# Altium project AudioDSP-v3.0.PrjPcb
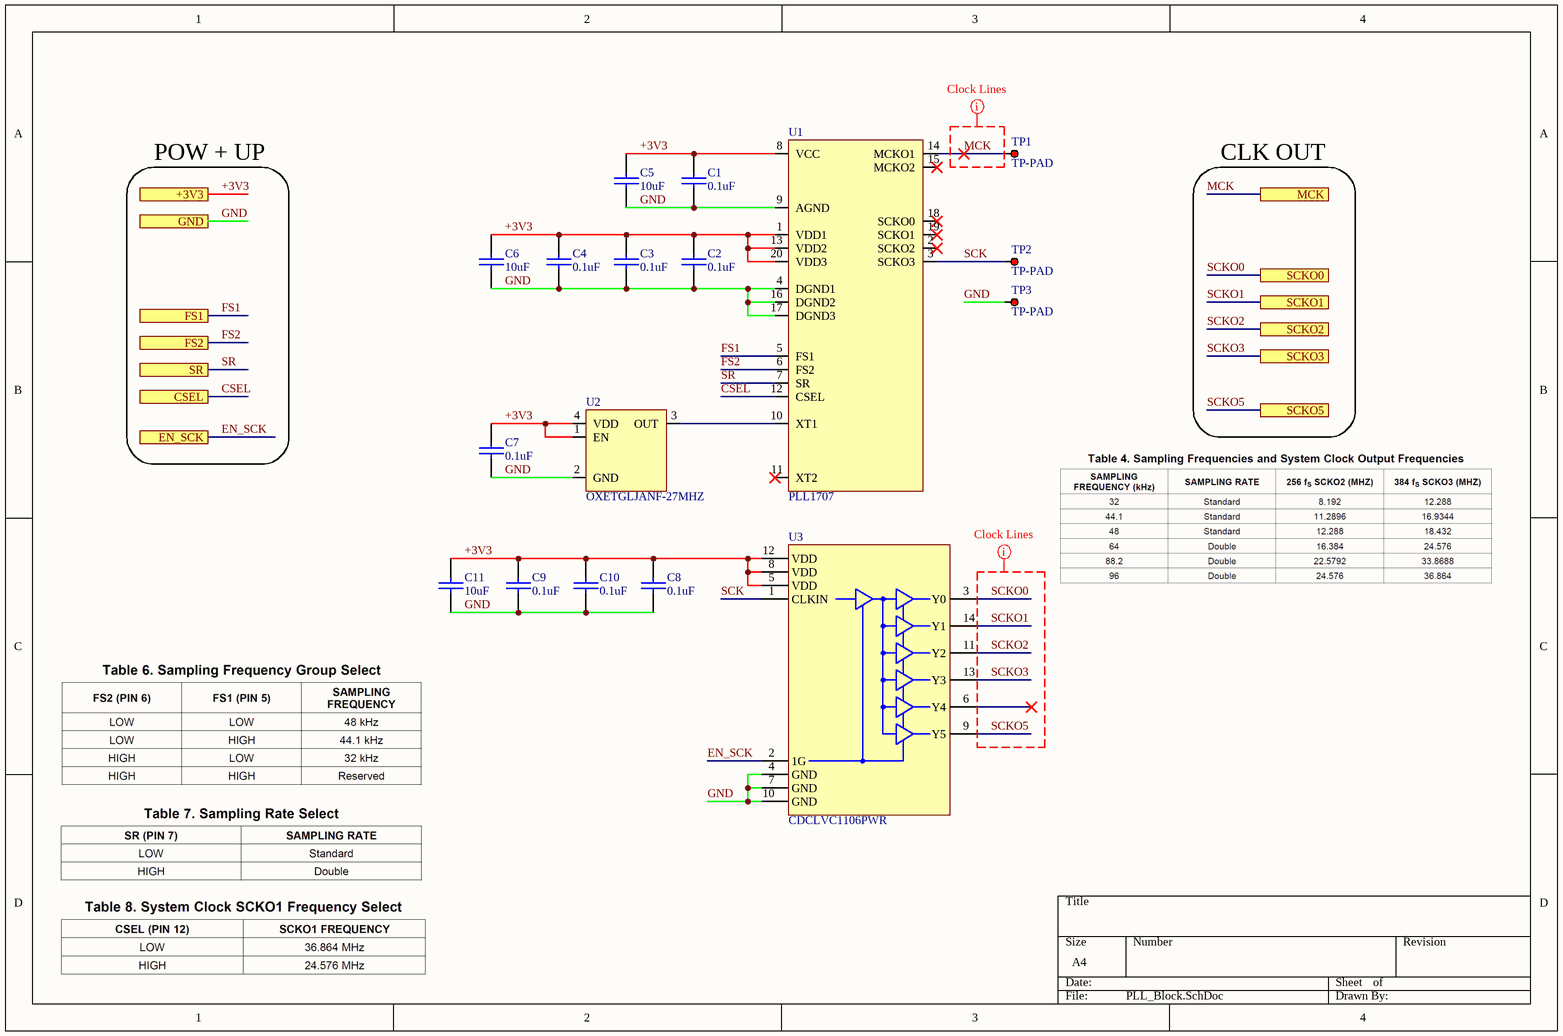
[diagram p0: PLL_Block.SchDoc]
11 sheets, 124 parts. Net scope: hierarchical (ports join the sheet entries above them; power ports are global).
Board file: AudioDSP-3.0.PcbDoc
Sheets:
  PLL_Block.SchDoc
  DAC_Block.SchDoc
  POW_Block.SchDoc
  IN_Connectors.SchDoc
  OUT_Connectors.SchDoc
  MCU_Block.SchDoc
  CTRL_Connectors.SchDoc
  ADC_Interface.SchDoc
  LPF_Interface.SchDoc
    LPF1 = LPF_Block.SchDoc
  DSP_Block.SchDoc

## Sheet PLL_Block.SchDoc
size A4; SheetNumber: 2; SheetTotal: 13

### Parts
(Parts that share a designator on the sheet are numbered #1, #2 ... from top to bottom, then left to right.)
C1#1  0.1uF  [0402-CAP-TDK]
C2#1  0.1uF  [0402-CAP-TDK]
C3#1  0.1uF  [0402-CAP-TDK]
C4#1  0.1uF  [0402-CAP-TDK]
C5#1  10uF  [0603-CAP-TDK]
C6#1  10uF  [0603-CAP-TDK]
C7#1  0.1uF  [0402-CAP-TDK]
C8#1  0.1uF  [0402-CAP-TDK]
C9#1  0.1uF  [0402-CAP-TDK]
C10#1  0.1uF  [0402-CAP-TDK]
C11#1  10uF  [0603-CAP-TDK]
TP1#1  TP-PAD  [TPTH - PAD TOP]  (no BOM)
TP2#1  TP-PAD  [TPTH - PAD TOP]  (no BOM)
TP3#1  TP-PAD  [TPTH - PAD TOP]  (no BOM)
U1#1  PLL1707  [TI-SSOP-20 - DBQ (R-PDSO-G20)]
U2#1  OXETGLJANF-27MHZ  [SMD3225]
U3  CDCLVC1106PWR  [TI-TSSOP-14-PW0014A]

### Ports
+3V3 (see AudioDSP-v3.0.0c_top[2C], ADC_Block[1A], ADC_Interface[1B], CTRL_Connectors[1A], DAC_Block[1B], DSP_Block[1A], MCU_Block[1A], POW_Block[4B]), CSEL (see AudioDSP-v3.0.0c_top[2C], MCU_Block[4C]), EN_SCK (see AudioDSP-v3.0.0c_top[2C], MCU_Block[4B]), FS1 (see AudioDSP-v3.0.0c_top[2C], MCU_Block[4B]), FS2 (see AudioDSP-v3.0.0c_top[2C], MCU_Block[4B]), GND (see AudioDSP-v3.0.0c_top[2C], ADC_Block[1B], ADC_Interface[1B], CTRL_Connectors[1A], DAC_Block[1B], DSP_Block[1A], IN_Connectors[3A], LPF_Block[1B], LPF_Interface[1B], MCU_Block[1B], OUT_Connectors[3B], POW_Block[1B]), MCK (see AudioDSP-v3.0.0c_top[3C]), SCKO0 (see AudioDSP-v3.0.0c_top[3C]), SCKO1 (see AudioDSP-v3.0.0c_top[3C]), SCKO2 (see AudioDSP-v3.0.0c_top[3C]), SCKO3 (see AudioDSP-v3.0.0c_top[3C]), SCKO5 (see AudioDSP-v3.0.0c_top[3C]), SR (see AudioDSP-v3.0.0c_top[2C], MCU_Block[4C])

### Nets
+3V3: C1#1.2 C2#1.2 C3#1.2 C4#1.2 C5#1.2 C6#1.2 C7#1.2 C8#1.2 C9#1.2 C10#1.2 C11#1.2 U1#1.1(VDD1) U1#1.8(VCC) U1#1.13(VDD2) U1#1.20(VDD3) U2#1.1(EN) U2#1.4(VDD) U3.5(VDD) U3.8(VDD) U3.12(VDD) ; port +3V3
CSEL: U1#1.12(CSEL) ; port CSEL
EN_SCK: U3.2(1G) ; port EN_SCK
FS1: U1#1.5(FS1) ; port FS1
FS2: U1#1.6(FS2) ; port FS2
GND: C1#1.1 C2#1.1 C3#1.1 C4#1.1 C5#1.1 C6#1.1 C7#1.1 C8#1.1 C9#1.1 C10#1.1 C11#1.1 TP3#1.1 U1#1.4(DGND1) U1#1.9(AGND) U1#1.16(DGND2) U1#1.17(DGND3) U2#1.2(GND) U3.4(GND) U3.7(GND) U3.10(GND) ; port GND
MCK: TP1#1.1 U1#1.14(MCKO1) ; port MCK
SCK: TP2#1.1 U1#1.3(SCKO3) U3.1(CLKIN)
SCKO0: U3.3(Y0) ; port SCKO0
SCKO1: U3.14(Y1) ; port SCKO1
SCKO2: U3.11(Y2) ; port SCKO2
SCKO3: U3.13(Y3) ; port SCKO3
SCKO5: U3.9(Y5) ; port SCKO5
SR: U1#1.7(SR) ; port SR
NetU1#1_10: U1#1.10(XT1) U2#1.3(OUT)

Not connected (* = marked no-connect by the designer): U1#1 2(SCKO2)* 11(XT2)* 15(MCKO2)* 18(SCKO0)* 19(SCKO1)*; U3 6(Y4)*

### Layout directives
net class CLK: MCK, SCKO0, SCKO1, SCKO2, SCKO3, SCKO5

### Notes on the sheet
- POW + UP
- CLK OUT

### Library data of the parts
C1#1 C2#1 C3#1 C4#1 C5#1 C6#1 C7#1 C8#1 C9#1 C10#1 C11#1 = CAP-SMD
  C1#1 C2#1 C3#1 C4#1 C7#1 C8#1 C9#1 C10#1: JLCPart: C307331
  C5#1 C6#1 C11#1: JLCPart: C96446
U1#1 = PLL1707: Dual PLL Multi-Clock Generator; JLCPart: C1519963
U2#1 = OXETGLJANF-27MHZ: 3.3V ±50ppm 27MHz SMD3225-4P Oscillators; JLCPart: C295526
U3 = CDCLVC1106PWR: LVCMOS High-Performance Clock Buffer 6-Output; JLCPart: C56506

## Sheet DAC_Block.SchDoc
size A4; SheetNumber: 3; SheetTotal: 13
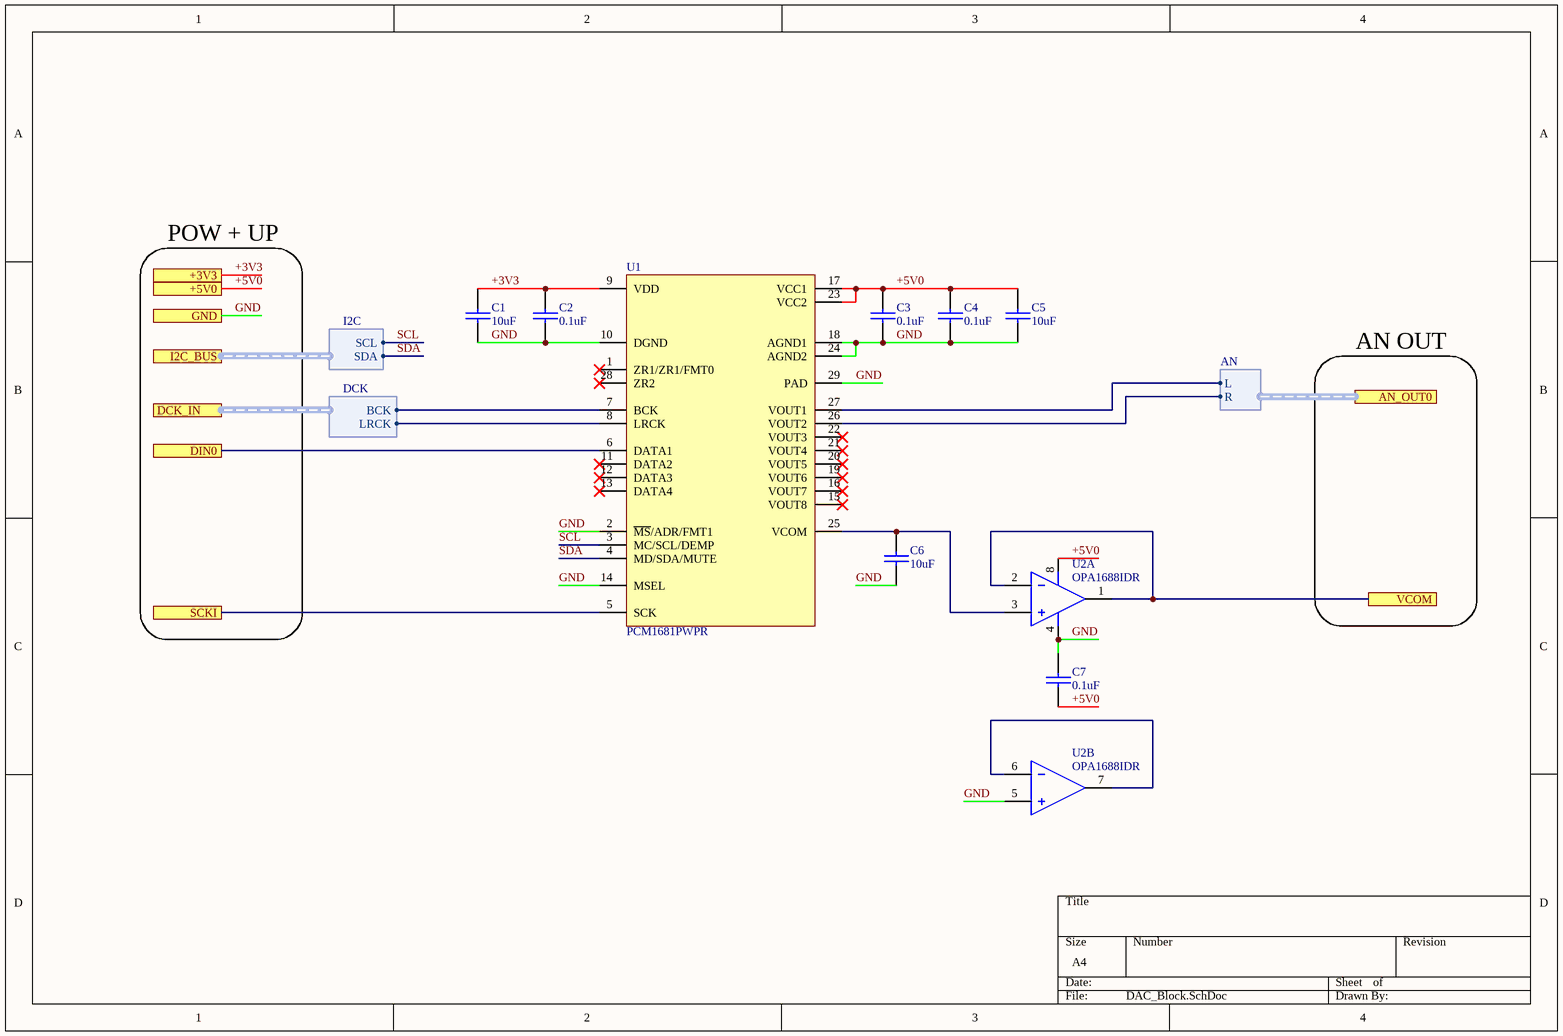
[diagram p1: DAC_Block.SchDoc]

### Parts
(Parts that share a designator on the sheet are numbered #1, #2 ... from top to bottom, then left to right.)
C1#2  10uF  [0603-CAP-TDK]
C2#2  0.1uF  [0402-CAP-TDK]
C3#2  0.1uF  [0402-CAP-TDK]
C4#2  0.1uF  [0402-CAP-TDK]
C5#2  10uF  [0603-CAP-TDK]
C6#2  10uF  [0603-CAP-TDK]
C7#2  0.1uF  [0402-CAP-TDK]
U1#2  PCM1681PWPR  [PCM1681PWPR]
U2#2  OPA1688IDR  [TI-SOIC-8]  (parts A,B of 2)

### Ports
+3V3 (see AudioDSP-v3.0.0c_top[6B], ADC_Block[1A], ADC_Interface[1B], CTRL_Connectors[1A], DSP_Block[1A], MCU_Block[1A], PLL_Block[1A], POW_Block[4B]), +5V0 (see AudioDSP-v3.0.0c_top[6B], LPF_Block[1B], LPF_Interface[1B], POW_Block[4B]), AN_OUT0 (harness AN, see AudioDSP-v3.0.0c_top[6B]), DCK_IN (harness DCK, see AudioDSP-v3.0.0c_top[6B]), DIN0 (see AudioDSP-v3.0.0c_top[6B]), GND (see AudioDSP-v3.0.0c_top[6B], ADC_Block[1B], ADC_Interface[1B], CTRL_Connectors[1A], DSP_Block[1A], IN_Connectors[3A], LPF_Block[1B], LPF_Interface[1B], MCU_Block[1B], OUT_Connectors[3B], PLL_Block[1A], POW_Block[1B]), I2C_BUS (harness I2C, see AudioDSP-v3.0.0c_top[6B], ADC_Block[1B]), SCKI (see AudioDSP-v3.0.0c_top[6B]), VCOM (see AudioDSP-v3.0.0c_top[6B], LPF_Block[1C], LPF_Interface[1B])

### Harnesses
I2C: SCL, SDA
DCK: BCK, LRCK
AN: L, R

### Nets
+3V3: C1#2.2 C2#2.2 U1#2.9(VDD) ; port +3V3
+5V0: C3#2.2 C4#2.2 C5#2.2 C7#2.1 U1#2.17(VCC1) U1#2.23(VCC2) U2#2.8(VDD) ; port +5V0
GND: C1#2.1 C2#2.1 C3#2.1 C4#2.1 C5#2.1 C6#2.1 C7#2.2 U1#2.2(~{MS}/ADR/FMT1) U1#2.10(DGND) U1#2.14(MSEL) U1#2.18(AGND1) U1#2.24(AGND2) U1#2.29(PAD) U2#2.4(GND) U2#2.5(2IN+) ; port GND
SCL: U1#2.3(MC/SCL/DEMP) ; port I2C_BUS.SCL
SDA: U1#2.4(MD/SDA/MUTE) ; port I2C_BUS.SDA
NetC6#2_2: C6#2.2 U1#2.25(VCOM) U2#2.3(1IN+)
NetU1#2_5: U1#2.5(SCK) ; port SCKI
NetU1#2_6: U1#2.6(DATA1) ; port DIN0
NetU1#2_7: U1#2.7(BCK) ; port DCK_IN.BCK
NetU1#2_8: U1#2.8(LRCK) ; port DCK_IN.LRCK
NetU1#2_26: U1#2.26(VOUT2) ; port AN_OUT0.R
NetU1#2_27: U1#2.27(VOUT1) ; port AN_OUT0.L
NetU2#2_1: U2#2.1(1OUT) U2#2.2(1IN-) ; port VCOM
NetU2#2_6: U2#2.6(2IN-) U2#2.7(2OUT)

Not connected (* = marked no-connect by the designer): U1#2 1(ZR1/ZR1/FMT0)* 11(DATA2)* 12(DATA3)* 13(DATA4)* 15(VOUT8)* 16(VOUT7)* 19(VOUT6)* 20(VOUT5)* 21(VOUT4)* 22(VOUT3)* 28(ZR2)*

### Notes on the sheet
- POW + UP
- AN OUT

### Library data of the parts
C1#2 C2#2 C3#2 C4#2 C5#2 C6#2 C7#2 = CAP-SMD
  C1#2 C5#2 C6#2: JLCPart: C96446
  C2#2 C3#2 C4#2 C7#2: JLCPart: C307331
U2#2 = OPA1688IDR: Rail-To-Rail Amplifier 2 Circuit - 8-SOIC; JLCPart: C206212
U1#2 = PCM1681PWPR: JLCPart: C181571

## Sheet POW_Block.SchDoc
size A4; SheetNumber: 5; SheetTotal: 13
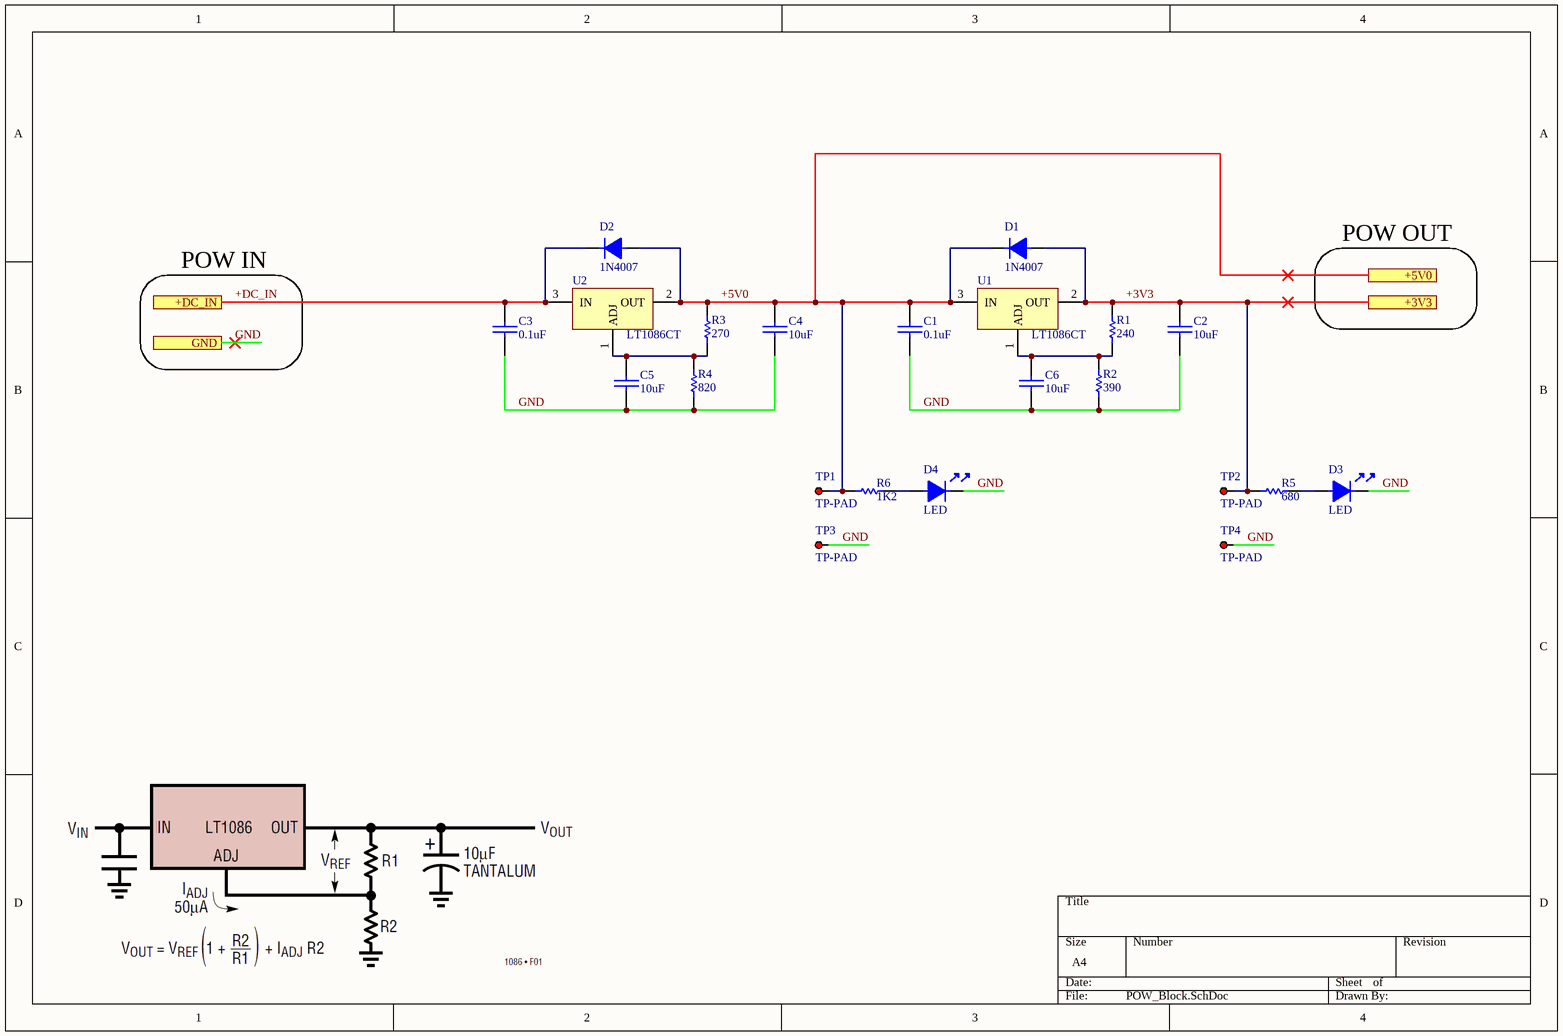
[diagram p2: POW_Block.SchDoc]

### Parts
(Parts that share a designator on the sheet are numbered #1, #2 ... from top to bottom, then left to right.)
C1#3  0.1uF  [0402-CAP-TDK]
C2#3  10uF  [0603-CAP-TDK]
C3#3  0.1uF  [0402-CAP-TDK]
C4#3  10uF  [0603-CAP-TDK]
C5#3  10uF  [0603-CAP-TDK]
C6#3  10uF  [0603-CAP-TDK]
D1#1  1N4007  [DO-214AC-SMA]
D2  1N4007  [DO-214AC-SMA]
D3  LED  [LED-0805]
D4  LED  [LED-0805]
R1#1  240  [0805-RES-PANASONIC]
R2#1  390  [0805-RES-PANASONIC]
R3#1  270  [0805-RES-PANASONIC]
R4#1  820  [0805-RES-PANASONIC]
R5#1  680  [0402-RES-PANASONIC]
R6#1  1K2  [0402-RES-PANASONIC]
TP1#2  TP-PAD  [TPTH - PAD TOP]  (no BOM)
TP2#2  TP-PAD  [TPTH - PAD TOP]  (no BOM)
TP3#2  TP-PAD  [TPTH - PAD TOP]  (no BOM)
TP4  TP-PAD  [TPTH - PAD TOP]  (no BOM)
U1#3  LT1086CT  [TO-220 - KCS0003B]
U2#3  LT1086CT  [TO-220 - KCS0003B]

### Ports
+3V3 (see AudioDSP-v2.0_top[2B], ADC_Block[1A], ADC_Interface[1B], CTRL_Connectors[1A], DAC_Block[1B], DSP_Block[1A], MCU_Block[1A], PLL_Block[1A]), +5V0 (see AudioDSP-v2.0_top[2B], DAC_Block[1B], LPF_Block[1B], LPF_Interface[1B]), +DC_IN (see AudioDSP-v2.0_top[2B], IN_Connectors[3A]), GND (see AudioDSP-v2.0_top[2B], ADC_Block[1B], ADC_Interface[1B], CTRL_Connectors[1A], DAC_Block[1B], DSP_Block[1B], IN_Connectors[3A], LPF_Block[1B], LPF_Interface[1B], MCU_Block[1B], OUT_Connectors[3B], PLL_Block[1A])

### Nets
+3V3: C2#3.2 D1#1.1 R1#1.2 R5#1.1 TP2#2.1 U1#3.2(OUT) ; port +3V3
+5V0: C1#3.2 C4#3.2 D1#1.2 D2.1 R3#1.2 R6#1.1 TP1#2.1 U1#3.3(IN) U2#3.2(OUT) ; port +5V0
+DC_IN: C3#3.2 D2.2 U2#3.3(IN) ; port +DC_IN
GND: C1#3.1 C2#3.1 C3#3.1 C4#3.1 C5#3.1 C6#3.1 D3.2 D4.2 R2#1.1 R4#1.1 TP3#2.1 TP4.1 ; port GND
NetC5#3_2: C5#3.2 R3#1.1 R4#1.2 U2#3.1(ADJ)
NetC6#3_2: C6#3.2 R1#1.1 R2#1.2 U1#3.1(ADJ)
NetD3_1: D3.1 R5#1.2
NetD4_1: D4.1 R6#1.2

### Notes on the sheet
- POW OUT
- POW IN

### Library data of the parts
C1#3 C2#3 C3#3 C4#3 C5#3 C6#3 = CAP-SMD
  C1#3 C3#3: JLCPart: C307331
  C2#3 C4#3 C5#3 C6#3: JLCPart: C96446
D1#1 D2 = 1N4007: Diode Rectifier 1A 1kV; JLCPart: C2892673
D3 D4 = LED-SMD: JLCPart: C84256
R1#1 R2#1 R3#1 R4#1 R5#1 R6#1 = RES-SMD
  R1#1: JLCPart: C17572
  R2#1: JLCPart: C17655
  R3#1: JLCPart: C17590
  R4#1: JLCPart: C17837
  R5#1: JLCPart: C25130
  R6#1: JLCPart: C25862

## Sheet IN_Connectors.SchDoc
size A4; SheetNumber: 5; SheetTotal: 13
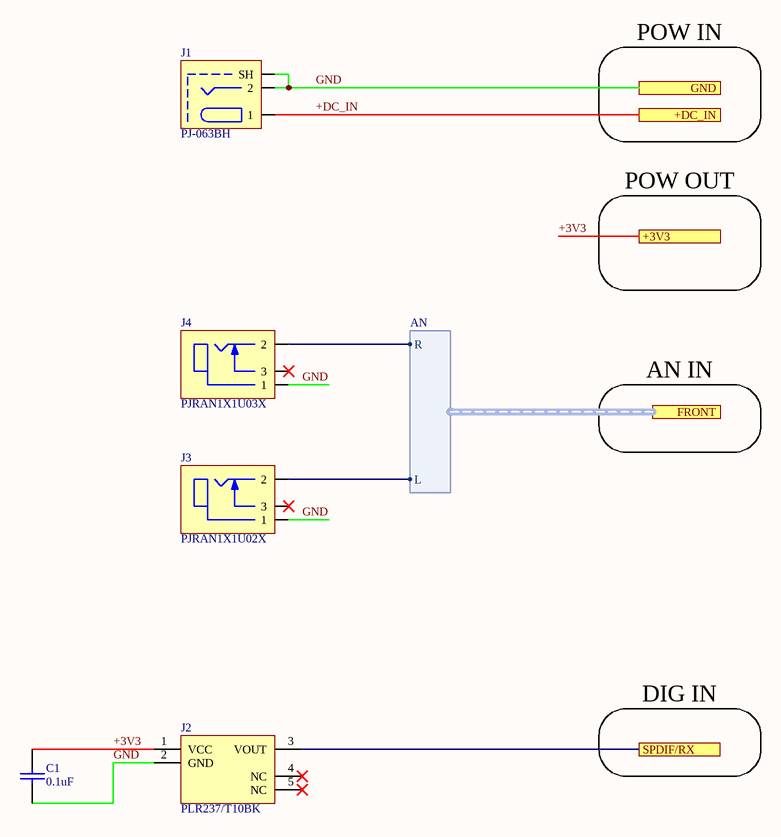
[diagram p3: IN_Connectors.SchDoc]

### Parts
(Parts that share a designator on the sheet are numbered #1, #2 ... from top to bottom, then left to right.)
C1#4  0.1uF  [0402-CAP-TDK]
J1  PJ-063BH  [PJ-063BH]
J2  PLR237/T10BK  [PLR237/T10BK]
J3  PJRAN1X1U02X  [RCA1X1-RA - SW]
J4  PJRAN1X1U03X  [RCA1X1-RA - SW]

### Ports
+3V3 (see AudioDSP-v3.0.0c_top[3A], ADC_Block[1A], ADC_Interface[1B], CTRL_Connectors[1A], DAC_Block[1B], DSP_Block[1A], MCU_Block[1A], OUT_Connectors[3B], PLL_Block[1A], POW_Block[4B]), +DC_IN (see AudioDSP-v3.0.0c_top[3A], POW_Block[1B]), FRONT (harness AN, see AudioDSP-v3.0.0c_top[3B]), GND (see AudioDSP-v3.0.0c_top[3A], ADC_Block[1B], ADC_Interface[1B], CTRL_Connectors[1A], DAC_Block[1B], DSP_Block[1A], LPF_Block[1B], LPF_Interface[1B], MCU_Block[1B], OUT_Connectors[3B], PLL_Block[1A], POW_Block[1B]), SPDIF/RX (see AudioDSP-v3.0.0c_top[3B], DSP_Block[1B])

### Harnesses
AN: L, R

### Nets
+3V3: C1#4.2 J2.1(VCC) ; port +3V3
+DC_IN: J1.1 ; port +DC_IN
GND: C1#4.1 J1.2 J1.3(SH) J2.2(GND) J3.1 J4.1 ; port GND
NetJ2_3: J2.3(VOUT) ; port SPDIF/RX
NetJ3_2: J3.2 ; port FRONT.L
NetJ4_2: J4.2 ; port FRONT.R

Not connected (* = marked no-connect by the designer): J2 4(NC)* 5(NC)*; J3 3*; J4 3*

### Notes on the sheet
- POW IN
- POW OUT
- AN IN
- DIG IN

### Library data of the parts
C1#4 = CAP-SMD: JLCPart: C307331
J1 = PJ-063BH: CONN POWER JACK 2.5X5.5MM RA; Digikey_PN: CP-063BH-ND
J3 = PJRAN1X1U02X: CONN RCA JACK MONO 3.2MM R/A WHITE; Digikey_PN: PJRAN1X1U02X-ND
J4 = PJRAN1X1U03X: CONN RCA JACK MONO 3.2MM R/A RED; Digikey_PN: PJRAN1X1U03X-ND
J2 = PLR237/T10BK: Digikey_PN: 1080-PLR237/T10BK-ND

## Sheet OUT_Connectors.SchDoc
size A4; SheetNumber: 6; SheetTotal: 13
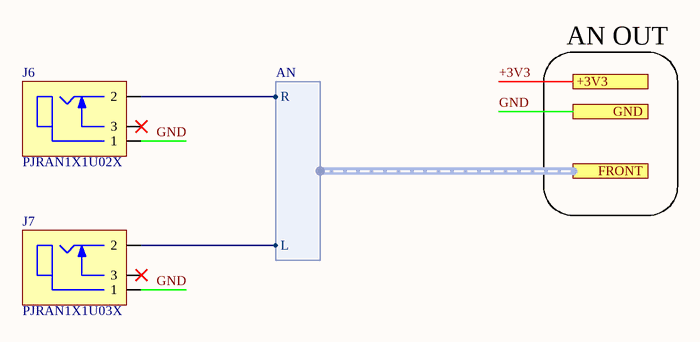
[diagram p4: OUT_Connectors.SchDoc]

### Parts
J6  PJRAN1X1U02X  [RCA1X1-RA - SW]
J7  PJRAN1X1U03X  [RCA1X1-RA - SW]

### Ports
+3V3 (see AudioDSP-v3.0.0c_top[8B], ADC_Block[1A], ADC_Interface[1B], CTRL_Connectors[1A], DAC_Block[1B], DSP_Block[1A], IN_Connectors[3B], MCU_Block[1A], PLL_Block[1A], POW_Block[4B]), FRONT (harness AN, see AudioDSP-v3.0.0c_top[8B]), GND (see AudioDSP-v3.0.0c_top[8B], ADC_Block[1B], ADC_Interface[1B], CTRL_Connectors[1A], DAC_Block[1B], DSP_Block[1A], IN_Connectors[3A], LPF_Block[1B], LPF_Interface[1B], MCU_Block[1B], PLL_Block[1A], POW_Block[1B])

### Harnesses
AN: L, R

### Nets
+3V3: port +3V3
GND: J6.1 J7.1 ; port GND
NetJ6_2: J6.2 ; port FRONT.R
NetJ7_2: J7.2 ; port FRONT.L

Not connected (* = marked no-connect by the designer): J6 3*; J7 3*

### Notes on the sheet
- AN OUT

### Library data of the parts
J6 = PJRAN1X1U02X: CONN RCA JACK MONO 3.2MM R/A WHITE; Digikey_PN: PJRAN1X1U02X-ND
J7 = PJRAN1X1U03X: CONN RCA JACK MONO 3.2MM R/A RED; Digikey_PN: PJRAN1X1U03X-ND

## Sheet MCU_Block.SchDoc
size A4; SheetNumber: 7; SheetTotal: 13
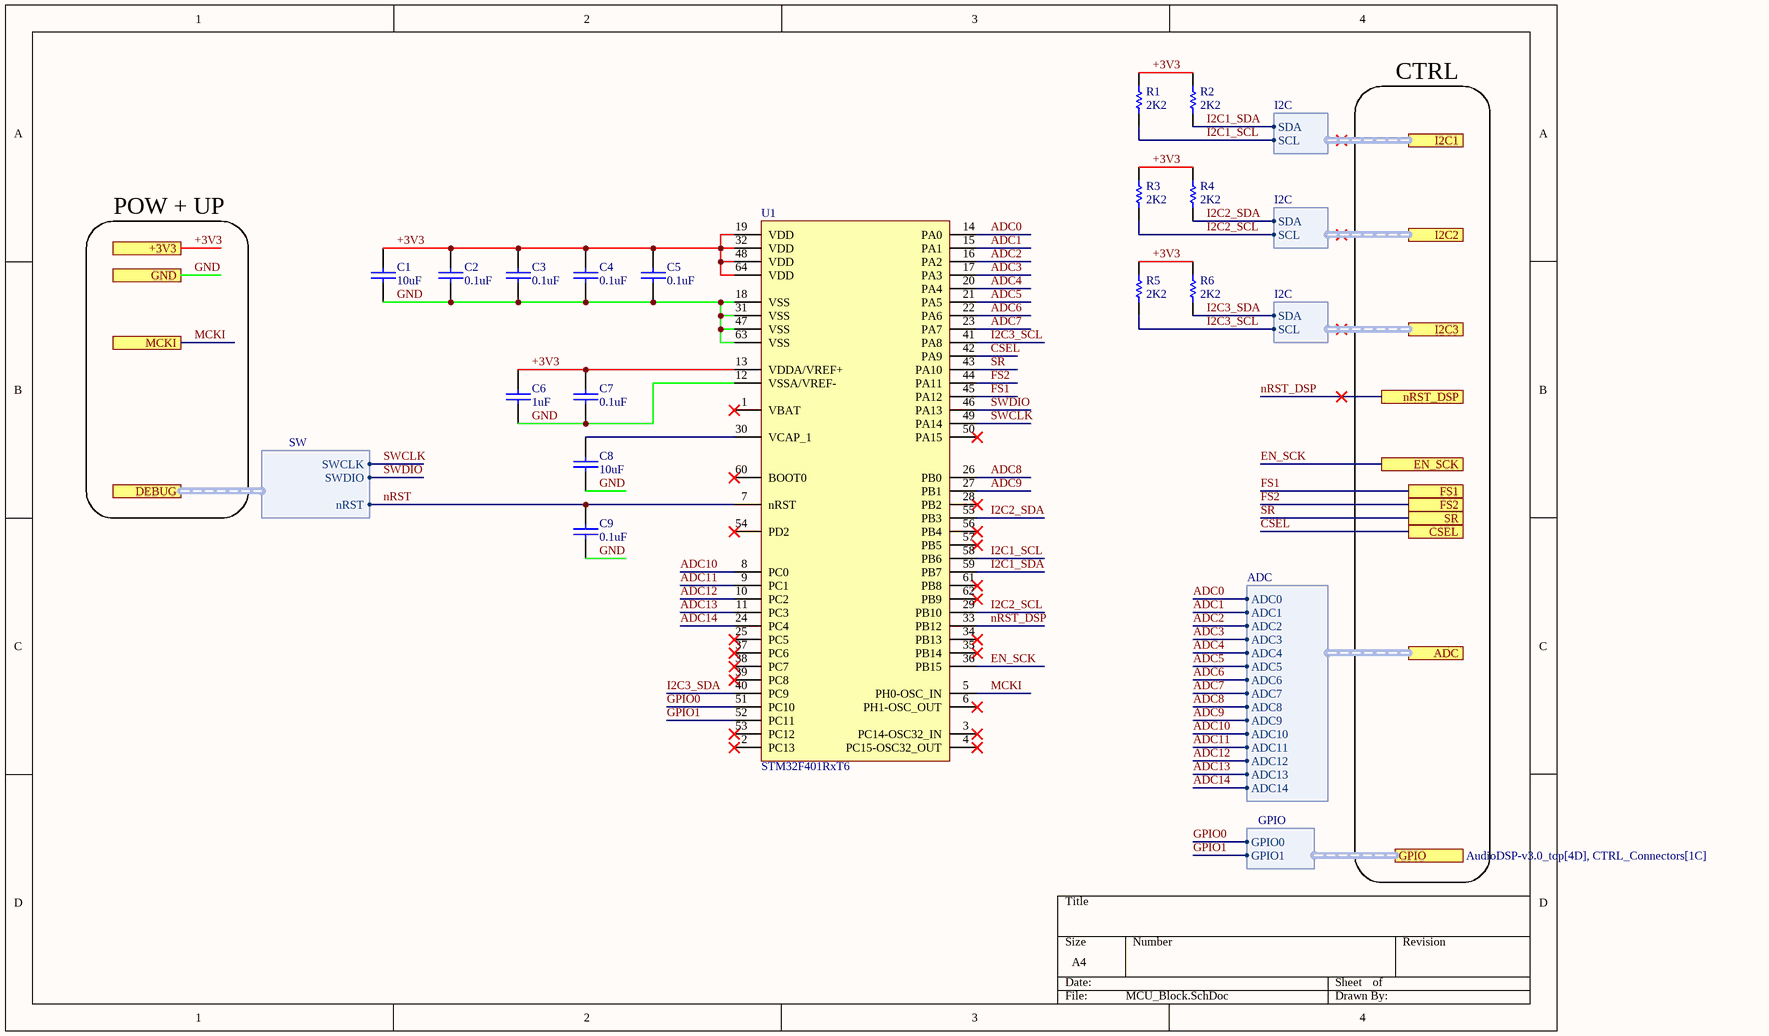
[diagram p5: MCU_Block.SchDoc]

### Parts
(Parts that share a designator on the sheet are numbered #1, #2 ... from top to bottom, then left to right.)
C1#5  10uF  [0603-CAP-TDK]
C2#4  0.1uF  [0402-CAP-TDK]
C3#4  0.1uF  [0402-CAP-TDK]
C4#4  0.1uF  [0402-CAP-TDK]
C5#4  0.1uF  [0402-CAP-TDK]
C6#4  1uF  [0603-CAP-TDK]
C7#3  0.1uF  [0402-CAP-TDK]
C8#2  10uF  [0603-CAP-TDK]
C9#2  0.1uF  [0402-CAP-TDK]
R1#2  2K2  [0402-RES-PANASONIC]
R2#2  2K2  [0402-RES-PANASONIC]
R3#2  2K2  [0402-RES-PANASONIC]
R4#2  2K2  [0402-RES-PANASONIC]
R5#2  2K2  [0402-RES-PANASONIC]
R6#2  2K2  [0402-RES-PANASONIC]
U1#4  STM32F401RxT6  [LQFP-64]

### Ports
+3V3 (see AudioDSP-v3.0_top[3C], ADC_Block[1A], ADC_Interface[1B], CTRL_Connectors[1A], DAC_Block[1B], DSP_Block[1A], PLL_Block[1A], POW_Block[4B]), ADC (harness ADC, see AudioDSP-v3.0_top[4D], CTRL_Connectors[1B]), CSEL (see AudioDSP-v3.0_top[4D], PLL_Block[1B]), DEBUG (harness SW, see AudioDSP-v3.0_top[4C], CTRL_Connectors[1B]), EN_SCK (see AudioDSP-v3.0_top[4D], PLL_Block[1B]), FS1 (see AudioDSP-v3.0_top[4D], PLL_Block[1B]), FS2 (see AudioDSP-v3.0_top[4D], PLL_Block[1B]), GND (see AudioDSP-v3.0_top[3D], ADC_Block[1B], ADC_Interface[1B], CTRL_Connectors[1A], DAC_Block[1B], DSP_Block[1A], IN_Connectors[3A], LPF_Block[1B], LPF_Interface[1B], OUT_Connectors[3B], PLL_Block[1A], POW_Block[1B]), GPIO (harness GPIO, see AudioDSP-v3.0_top[4D], CTRL_Connectors[1C]), I2C1 (harness I2C, see AudioDSP-v3.0_top[4D]), I2C2 (harness I2C, see AudioDSP-v3.0_top[4D], ADC_Interface[1B]), I2C3 (harness I2C, see AudioDSP-v3.0_top[4D]), MCKI (see AudioDSP-v3.0_top[3D]), nRST_DSP (see AudioDSP-v3.0_top[4D]), SR (see AudioDSP-v3.0_top[4D], PLL_Block[1B])

### Harnesses
SW: SWCLK, SWDIO, nRST
ADC: ADC0, ADC1, ADC2, ADC3, ADC4, ADC5, ADC6, ADC7, ADC8, ADC9, ADC10, ADC11, ADC12, ADC13, ADC14
I2C: SCL, SDA
GPIO: GPIO0, GPIO1

### Nets
+3V3: C1#5.2 C2#4.2 C3#4.2 C4#4.2 C5#4.2 C6#4.2 C7#3.2 R1#2.2 R2#2.2 R3#2.2 R4#2.2 R5#2.2 R6#2.2 U1#4.13(VDDA/VREF+) U1#4.19(VDD) U1#4.32(VDD) U1#4.48(VDD) U1#4.64(VDD) ; port +3V3
ADC0: U1#4.14(PA0) ; port ADC.ADC0
ADC1: U1#4.15(PA1) ; port ADC.ADC1
ADC2: U1#4.16(PA2) ; port ADC.ADC2
ADC3: U1#4.17(PA3) ; port ADC.ADC3
ADC4: U1#4.20(PA4) ; port ADC.ADC4
ADC5: U1#4.21(PA5) ; port ADC.ADC5
ADC6: U1#4.22(PA6) ; port ADC.ADC6
ADC7: U1#4.23(PA7) ; port ADC.ADC7
ADC8: U1#4.26(PB0) ; port ADC.ADC8
ADC9: U1#4.27(PB1) ; port ADC.ADC9
ADC10: U1#4.8(PC0) ; port ADC.ADC10
ADC11: U1#4.9(PC1) ; port ADC.ADC11
ADC12: U1#4.10(PC2) ; port ADC.ADC12
ADC13: U1#4.11(PC3) ; port ADC.ADC13
ADC14: U1#4.24(PC4) ; port ADC.ADC14
CSEL: U1#4.42(PA9) ; port CSEL
EN_SCK: U1#4.36(PB15) ; port EN_SCK
FS1: U1#4.45(PA12) ; port FS1
FS2: U1#4.44(PA11) ; port FS2
GND: C1#5.1 C2#4.1 C3#4.1 C4#4.1 C5#4.1 C6#4.1 C7#3.1 C8#2.1 C9#2.1 U1#4.12(VSSA/VREF-) U1#4.18(VSS) U1#4.31(VSS) U1#4.47(VSS) U1#4.63(VSS) ; port GND
GPIO0: U1#4.51(PC10) ; port GPIO.GPIO0
GPIO1: U1#4.52(PC11) ; port GPIO.GPIO1
I2C1_SCL: R1#2.1 U1#4.58(PB6) ; port I2C1.SCL
I2C1_SDA: R2#2.1 U1#4.59(PB7) ; port I2C1.SDA
I2C2_SCL: R3#2.1 U1#4.29(PB10) ; port I2C2.SCL
I2C2_SDA: R4#2.1 U1#4.55(PB3) ; port I2C2.SDA
I2C3_SCL: R5#2.1 U1#4.41(PA8) ; port I2C3.SCL
I2C3_SDA: R6#2.1 U1#4.40(PC9) ; port I2C3.SDA
MCKI: U1#4.5(PH0-OSC_IN) ; port MCKI
nRST: C9#2.2 U1#4.7(nRST) ; port DEBUG.nRST
nRST_DSP: U1#4.33(PB12) ; port nRST_DSP
SR: U1#4.43(PA10) ; port SR
SWCLK: U1#4.49(PA14) ; port DEBUG.SWCLK
SWDIO: U1#4.46(PA13) ; port DEBUG.SWDIO
NetC8#2_2: C8#2.2 U1#4.30(VCAP_1)

Not connected (* = marked no-connect by the designer): U1#4 1(VBAT)* 2(PC13)* 3(PC14-OSC32_IN)* 4(PC15-OSC32_OUT)* 6(PH1-OSC_OUT)* 25(PC5)* 28(PB2)* 34(PB13)* 35(PB14)* 37(PC6)* 38(PC7)* 39(PC8)* 50(PA15)* 53(PC12)* 54(PD2)* 56(PB4)* 57(PB5)* 60(BOOT0)* 61(PB8)* 62(PB9)*

### Notes on the sheet
- CTRL
- POW + UP

### Library data of the parts
C1#5 C2#4 C3#4 C4#4 C5#4 C6#4 C7#3 C8#2 C9#2 = CAP-SMD
  C1#5 C8#2: JLCPart: C96446
  C2#4 C3#4 C4#4 C5#4 C7#3 C9#2: JLCPart: C307331
  C6#4: JLCPart: C15849
R1#2 R2#2 R3#2 R4#2 R5#2 R6#2 = RES-SMD: JLCPart: C25879
U1#4 = STM32F401RxT6: JLCPart: C74524

## Sheet CTRL_Connectors.SchDoc
size A4; SheetNumber: 8; SheetTotal: 13
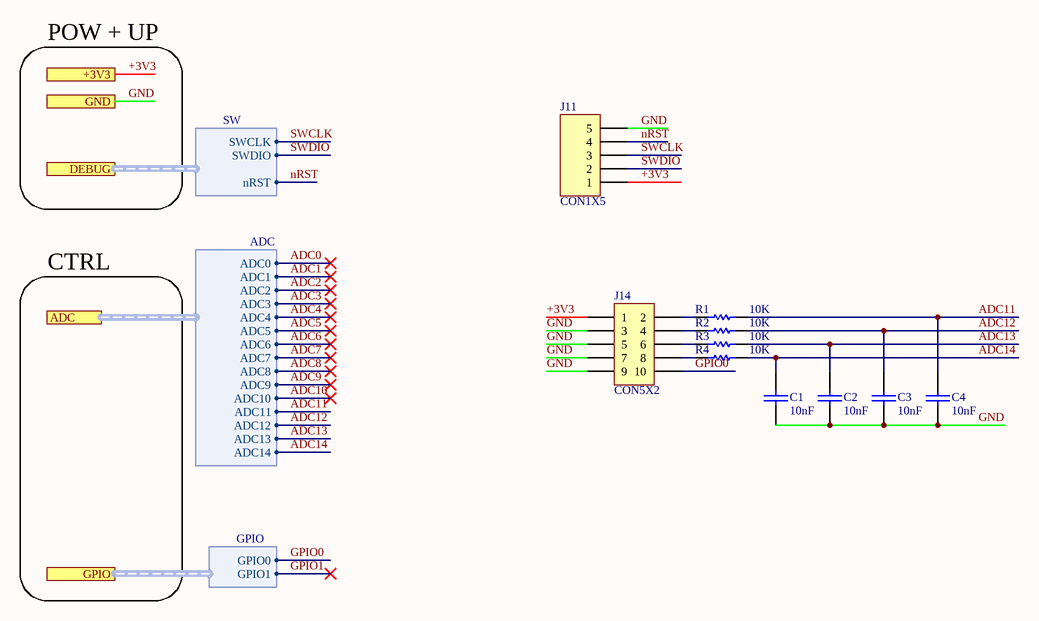
[diagram p6: CTRL_Connectors.SchDoc]

### Parts
(Parts that share a designator on the sheet are numbered #1, #2 ... from top to bottom, then left to right.)
C1#6  10nF  [0402-CAP-TDK]
C2#5  10nF  [0402-CAP-TDK]
C3#5  10nF  [0402-CAP-TDK]
C4#5  10nF  [0402-CAP-TDK]
J11  CON1X5  [SIP1X5]
J14  CON5X2  [SIP5X2]
R1#3  10K  [0402-RES-PANASONIC]
R2#3  10K  [0402-RES-PANASONIC]
R3#3  10K  [0402-RES-PANASONIC]
R4#3  10K  [0402-RES-PANASONIC]

### Ports
+3V3 (see AudioDSP-v3.0.0c_top[2B], ADC_Block[1A], ADC_Interface[1B], DAC_Block[1B], DSP_Block[1A], IN_Connectors[3B], MCU_Block[1A], OUT_Connectors[3B], PLL_Block[1A], POW_Block[4B]), ADC (harness ADC, see AudioDSP-v3.0.0c_top[2B], MCU_Block[4C]), DEBUG (harness SW, see AudioDSP-v3.0.0c_top[2B], MCU_Block[1B]), GND (see AudioDSP-v3.0.0c_top[2B], ADC_Block[1B], ADC_Interface[1B], DAC_Block[1B], DSP_Block[1A], IN_Connectors[3A], LPF_Block[1B], LPF_Interface[1B], MCU_Block[1B], OUT_Connectors[3B], PLL_Block[1A], POW_Block[1B]), GPIO (harness GPIO, see AudioDSP-v3.0.0c_top[2B], MCU_Block[4D])

### Harnesses
SW: SWCLK, SWDIO, nRST
ADC: ADC0, ADC1, ADC2, ADC3, ADC4, ADC5, ADC6, ADC7, ADC8, ADC9, ADC10, ADC11, ADC12, ADC13, ADC14
GPIO: GPIO0, GPIO1

### Nets
+3V3: J11.1 J14.1 ; port +3V3
ADC0: port ADC.ADC0
ADC1: port ADC.ADC1
ADC2: port ADC.ADC2
ADC3: port ADC.ADC3
ADC4: port ADC.ADC4
ADC5: port ADC.ADC5
ADC6: port ADC.ADC6
ADC7: port ADC.ADC7
ADC8: port ADC.ADC8
ADC9: port ADC.ADC9
ADC10: port ADC.ADC10
ADC11: C4#5.2 R1#3.2 ; port ADC.ADC11
ADC12: C3#5.2 R2#3.2 ; port ADC.ADC12
ADC13: C2#5.2 R3#3.2 ; port ADC.ADC13
ADC14: C1#6.2 R4#3.2 ; port ADC.ADC14
GND: C1#6.1 C2#5.1 C3#5.1 C4#5.1 J11.5 J14.3 J14.5 J14.7 J14.9 ; port GND
GPIO0: J14.10 ; port GPIO.GPIO0
GPIO1: port GPIO.GPIO1
nRST: J11.4 ; port DEBUG.nRST
SWCLK: J11.3 ; port DEBUG.SWCLK
SWDIO: J11.2 ; port DEBUG.SWDIO
NetJ14_2: J14.2 R1#3.1
NetJ14_4: J14.4 R2#3.1
NetJ14_6: J14.6 R3#3.1
NetJ14_8: J14.8 R4#3.1

### Notes on the sheet
- POW + UP
- CTRL

### Library data of the parts
C1#6 C2#5 C3#5 C4#5 = CAP-SMD
R1#3 R2#3 R3#3 R4#3 = RES-SMD

## Sheet ADC_Interface.SchDoc
size A4; SheetNumber: 9; SheetTotal: 13
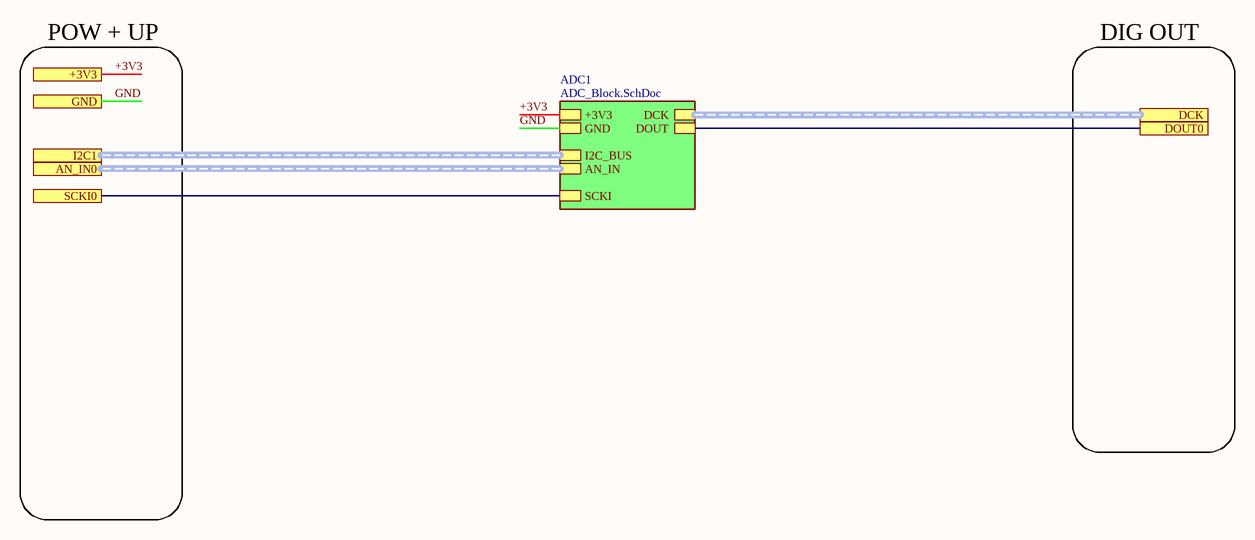
[diagram p7: ADC_Interface.SchDoc]

### Sub-sheets
ADC1 = ADC_Block.SchDoc (file not in this document): +3V3, GND, I2C_BUS (harness I2C), AN_IN (harness AN), SCKI, DCK (harness DCK), DOUT

### Ports
+3V3 (see AudioDSP-v3.0.0c_top[4B], ADC_Block[1A], CTRL_Connectors[1A], DAC_Block[1B], DSP_Block[1A], MCU_Block[1A], PLL_Block[1A], POW_Block[4B]), AN_IN0 (harness AN, see AudioDSP-v3.0.0c_top[4B]), DCK (harness DCK, see AudioDSP-v3.0.0c_top[4B], ADC_Block[4B]), DOUT0 (see AudioDSP-v3.0.0c_top[4B]), GND (see AudioDSP-v3.0.0c_top[4B], ADC_Block[1B], CTRL_Connectors[1A], DAC_Block[1B], DSP_Block[1A], IN_Connectors[3A], LPF_Block[1B], LPF_Interface[1B], MCU_Block[1B], OUT_Connectors[3B], PLL_Block[1A], POW_Block[1B]), I2C1 (harness I2C, see AudioDSP-v3.0.0c_top[4B]), SCKI0 (see AudioDSP-v3.0.0c_top[4B])

### Nets
+3V3: port +3V3, sheet ADC1/+3V3
GND: port GND, sheet ADC1/GND
(unnamed): port SCKI0, sheet ADC1/SCKI
(unnamed): port DOUT0, sheet ADC1/DOUT

### Buses and harness runs
harness port AN_IN0 = sheet ADC1/AN_IN
harness port DCK = sheet ADC1/DCK
harness port I2C1 = sheet ADC1/I2C_BUS

### Notes on the sheet
- POW + UP
- DIG OUT

## Sheet LPF_Interface.SchDoc
size A4; SheetNumber: 11; SheetTotal: 13
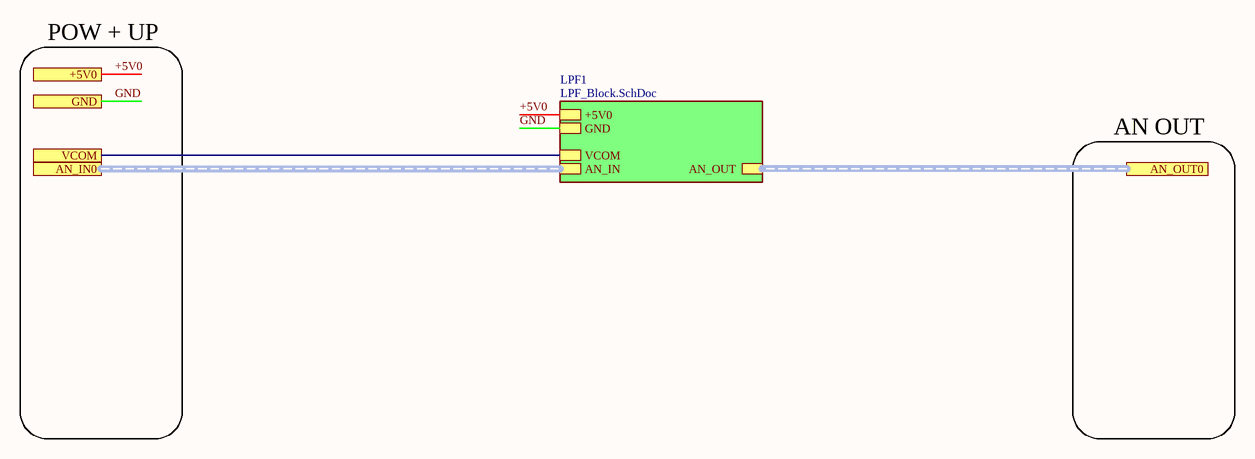
[diagram p8: LPF_Interface.SchDoc]

### Sub-sheets
LPF1 = LPF_Block.SchDoc: GND, +5V0, VCOM, AN_IN (harness AN), AN_OUT (harness AN)

### Ports
+5V0 (see AudioDSP-v3.0.0c_top[7B], DAC_Block[1B], LPF_Block[1B], POW_Block[4B]), AN_IN0 (harness AN, see AudioDSP-v3.0.0c_top[7B]), AN_OUT0 (harness AN, see AudioDSP-v3.0.0c_top[7B]), GND (see AudioDSP-v3.0.0c_top[7B], ADC_Block[1B], ADC_Interface[1B], CTRL_Connectors[1A], DAC_Block[1B], DSP_Block[1A], IN_Connectors[3A], LPF_Block[1B], MCU_Block[1B], OUT_Connectors[3B], PLL_Block[1A], POW_Block[1B]), VCOM (see AudioDSP-v3.0.0c_top[7B], DAC_Block[4C], LPF_Block[1C])

### Nets
+5V0: port +5V0, sheet LPF1/+5V0
GND: port GND, sheet LPF1/GND
VCOM: port VCOM, sheet LPF1/VCOM

### Buses and harness runs
harness port AN_IN0 = sheet LPF1/AN_IN
harness port AN_OUT0 = sheet LPF1/AN_OUT

### Notes on the sheet
- POW + UP
- AN OUT

## Sheet LPF_Block.SchDoc
size A4; SheetNumber: 13; SheetTotal: 13
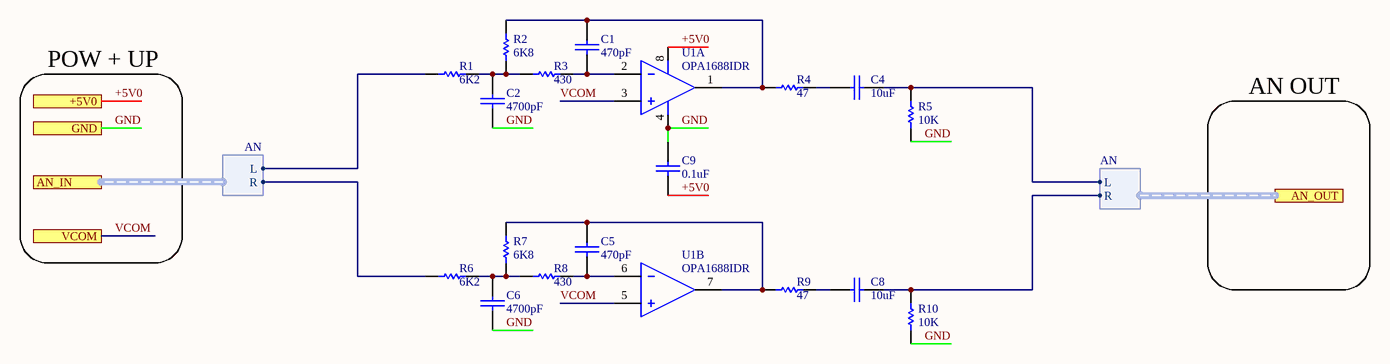
[diagram p9: LPF_Block.SchDoc]

### Parts
(Parts that share a designator on the sheet are numbered #1, #2 ... from top to bottom, then left to right.)
C1#7  470pF  [0402-CAP-TDK]
C2#6  4700pF  [0402-CAP-TDK]
C4#6  10uF  [0603-CAP-TDK]
C5#5  470pF  [0402-CAP-TDK]
C6#5  4700pF  [0402-CAP-TDK]
C8#3  10uF  [0603-CAP-TDK]
C9#3  0.1uF  [0402-CAP-TDK]
R1#4  6K2  [0603-RES-PANASONIC]
R2#4  6K8  [0402-RES-PANASONIC]
R3#4  430  [0402-RES-PANASONIC]
R4#4  47  [0402-RES-PANASONIC]
R5#3  10K  [0402-RES-PANASONIC]
R6#3  6K2  [0603-RES-PANASONIC]
R7  6K8  [0402-RES-PANASONIC]
R8  430  [0402-RES-PANASONIC]
R9  47  [0402-RES-PANASONIC]
R10  10K  [0402-RES-PANASONIC]
U1#5  OPA1688IDR  [TI-SOIC-8]  (parts A,B of 2)

### Ports
+5V0 (see LPF_Interface[2B], DAC_Block[1B], LPF_Interface[1B], POW_Block[4B]), AN_IN (harness AN, see LPF_Interface[2B]), AN_OUT (harness AN, see LPF_Interface[3B]), GND (see LPF_Interface[2B], ADC_Block[1B], ADC_Interface[1B], CTRL_Connectors[1A], DAC_Block[1B], DSP_Block[1B], IN_Connectors[3A], LPF_Interface[1B], MCU_Block[1B], OUT_Connectors[3B], PLL_Block[1A], POW_Block[1B]), VCOM (see LPF_Interface[2B], DAC_Block[4C], LPF_Interface[1B])

### Harnesses
AN: L, R

### Nets
+5V0: C9#3.1 U1#5.8(VDD) ; port +5V0
GND: C2#6.1 C6#5.1 C9#3.2 R5#3.1 R10.1 U1#5.4(GND) ; port GND
VCOM: U1#5.3(1IN+) U1#5.5(2IN+) ; port VCOM
NetC1#7_1: C1#7.1 R3#4.1 U1#5.2(1IN-)
NetC1#7_2: C1#7.2 R2#4.2 R4#4.2 U1#5.1(1OUT)
NetC2#6_2: C2#6.2 R1#4.1 R2#4.1 R3#4.2
NetC4#6_1: C4#6.1 R5#3.2 ; port AN_OUT.L
NetC4#6_2: C4#6.2 R4#4.1
NetC5#5_1: C5#5.1 R8.1 U1#5.6(2IN-)
NetC5#5_2: C5#5.2 R7.2 R9.2 U1#5.7(2OUT)
NetC6#5_2: C6#5.2 R6#3.1 R7.1 R8.2
NetC8#3_1: C8#3.1 R10.2 ; port AN_OUT.R
NetC8#3_2: C8#3.2 R9.1
NetR1#4_2: R1#4.2 ; port AN_IN.L
NetR6#3_2: R6#3.2 ; port AN_IN.R

### Notes on the sheet
- POW + UP
- AN OUT

### Library data of the parts
C1#7 C2#6 C4#6 C5#5 C6#5 C8#3 C9#3 = CAP-SMD
  C1#7 C5#5: JLCPart: C1537
  C2#6 C6#5: JLCPart: C1538
  C4#6 C8#3: JLCPart: C96446
  C9#3: JLCPart: C307331
R1#4 R2#4 R3#4 R4#4 R5#3 R6#3 R7-R10 = RES-SMD
  R1#4 R6#3: JLCPart: C4260
  R2#4 R7: JLCPart: C25917
  R3#4 R8: JLCPart: C2770705
  R4#4 R9: JLCPart: C25118
  R5#3 R10: JLCPart: C25744
U1#5 = OPA1688IDR: as U2#2 on sheet DAC_Block; JLCPart: C206212

## Sheet DSP_Block.SchDoc
size A4; SheetNumber: 13; SheetTotal: 13
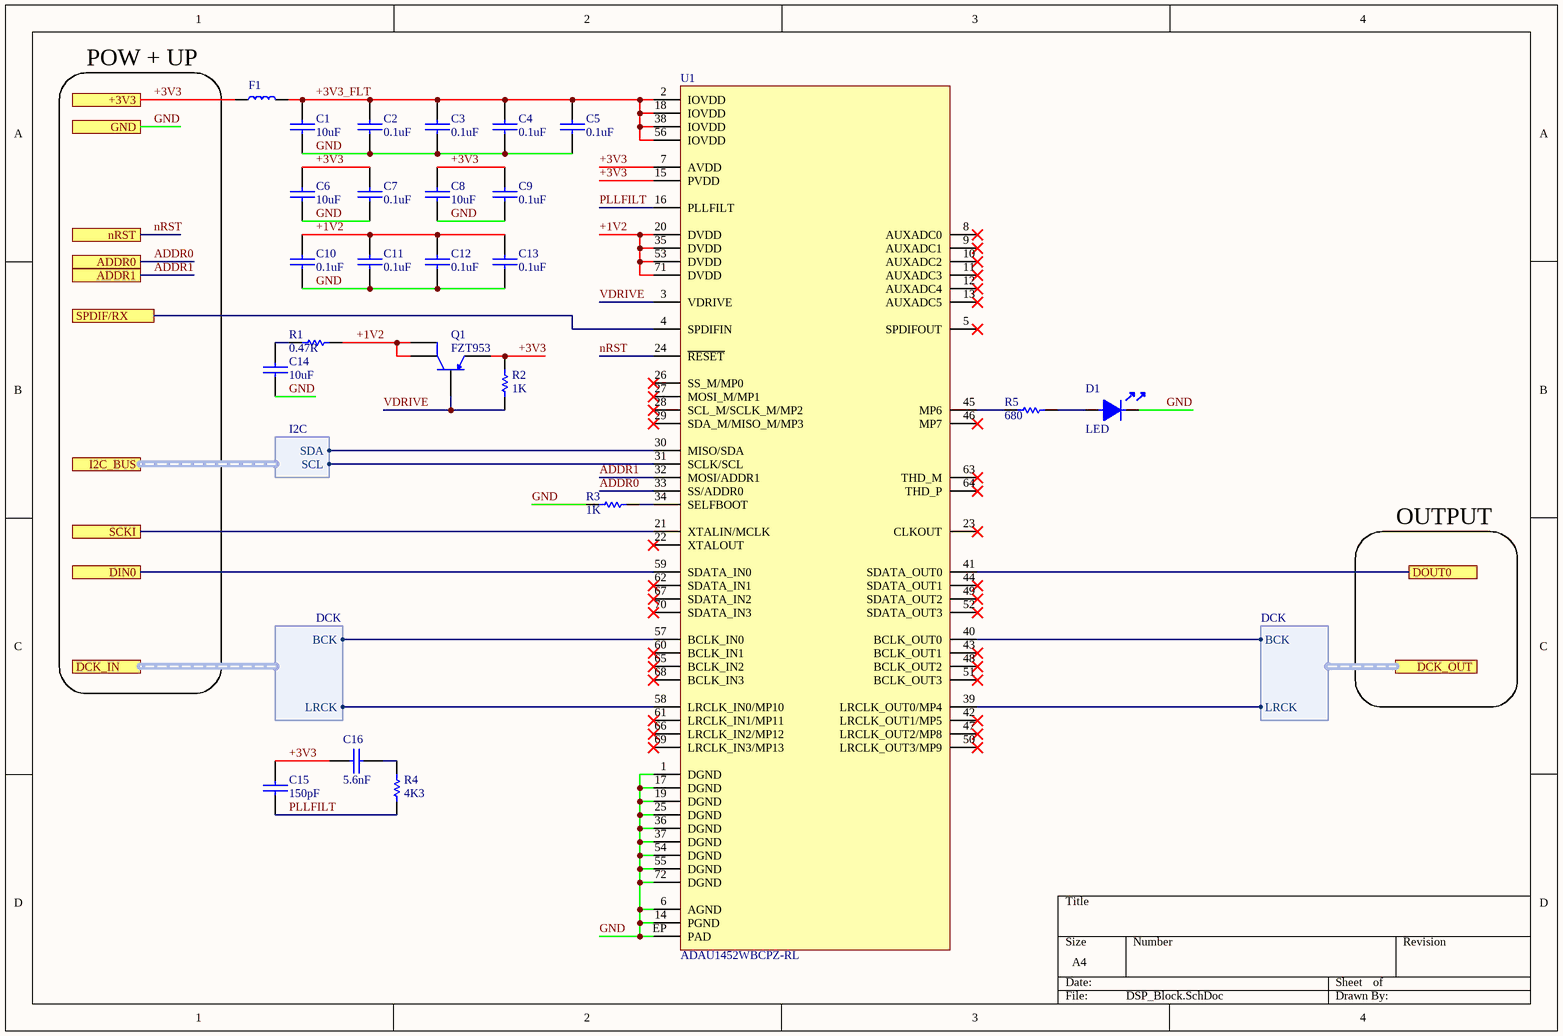
[diagram p10: DSP_Block.SchDoc]

### Parts
(Parts that share a designator on the sheet are numbered #1, #2 ... from top to bottom, then left to right.)
C1#8  10uF  [0603-CAP-TDK]
C2#7  0.1uF  [0402-CAP-TDK]
C3#6  0.1uF  [0402-CAP-TDK]
C4#7  0.1uF  [0402-CAP-TDK]
C5#6  0.1uF  [0402-CAP-TDK]
C6#6  10uF  [0603-CAP-TDK]
C7#4  0.1uF  [0402-CAP-TDK]
C8#4  10uF  [0603-CAP-TDK]
C9#4  0.1uF  [0402-CAP-TDK]
C10#2  0.1uF  [0402-CAP-TDK]
C11#2  0.1uF  [0402-CAP-TDK]
C12  0.1uF  [0402-CAP-TDK]
C13  0.1uF  [0402-CAP-TDK]
C14  10uF  [0603-CAP-TDK]
C15  150pF  [0402-CAP-TDK]
C16  5.6nF  [0402-CAP-TDK]
D1#2  LED  [LED-0805]
F1  YI201209U301-2R0T  [0805-IND]  (value not drawn)
Q1  FZT953  [SOT223-DN]
R1#5  0.47R  [0805-RES-PANASONIC]
R2#5  1K  [0402-RES-PANASONIC]
R3#5  1K  [0402-RES-PANASONIC]
R4#5  4K3  [0402-RES-PANASONIC]
R5#4  680  [0402-RES-PANASONIC]
U1#6  ADAU1452WBCPZ-RL  [LFCSP-VQ-72]

### Ports
+3V3 (see AudioDSP-v3.0.0c_top[5A], ADC_Block[1A], ADC_Interface[1B], CTRL_Connectors[1A], DAC_Block[1B], IN_Connectors[3B], MCU_Block[1A], OUT_Connectors[3B], PLL_Block[1A], POW_Block[4B]), ADDR0 (see AudioDSP-v3.0.0c_top[5B]), ADDR1 (see AudioDSP-v3.0.0c_top[5B]), DCK_IN (harness DCK, see AudioDSP-v3.0.0c_top[5B]), DCK_OUT (harness DCK, see AudioDSP-v3.0.0c_top[5B]), DIN0 (see AudioDSP-v3.0.0c_top[5B]), DOUT0 (see AudioDSP-v3.0.0c_top[5B]), GND (see AudioDSP-v3.0.0c_top[5A], ADC_Block[1B], ADC_Interface[1B], CTRL_Connectors[1A], DAC_Block[1B], IN_Connectors[3A], LPF_Block[1B], LPF_Interface[1B], MCU_Block[1B], OUT_Connectors[3B], PLL_Block[1A], POW_Block[1B]), I2C_BUS (harness I2C, see AudioDSP-v3.0.0c_top[5B]), nRST (see AudioDSP-v3.0.0c_top[5B]), SCKI (see AudioDSP-v3.0.0c_top[5B]), SPDIF/RX (see AudioDSP-v3.0.0c_top[5B], IN_Connectors[3D])

### Harnesses
I2C: SCL, SDA
DCK: BCK, LRCK

### Nets
+1V2: C10#2.2 C11#2.2 C12.2 C13.2 Q1.C Q1.C-TAB R1#5.1 U1#6.20(DVDD) U1#6.35(DVDD) U1#6.53(DVDD) U1#6.71(DVDD)
+3V3: C6#6.2 C7#4.2 C8#4.2 C9#4.2 C15.2 C16.2 F1.2 Q1.E R2#5.2 U1#6.7(AVDD) U1#6.15(PVDD) ; port +3V3
+3V3_FLT: C1#8.2 C2#7.2 C3#6.2 C4#7.2 C5#6.2 F1.1 U1#6.2(IOVDD) U1#6.18(IOVDD) U1#6.38(IOVDD) U1#6.56(IOVDD)
ADDR0: U1#6.33(SS/ADDR0) ; port ADDR0
ADDR1: U1#6.32(MOSI/ADDR1) ; port ADDR1
GND: C1#8.1 C2#7.1 C3#6.1 C4#7.1 C5#6.1 C6#6.1 C7#4.1 C8#4.1 C9#4.1 C10#2.1 C11#2.1 C12.1 C13.1 C14.1 D1#2.2 R3#5.2 U1#6.1(DGND) U1#6.6(AGND) U1#6.14(PGND) U1#6.17(DGND) U1#6.19(DGND) U1#6.25(DGND) U1#6.36(DGND) U1#6.37(DGND) U1#6.54(DGND) U1#6.55(DGND) U1#6.72(DGND) U1#6.EP(PAD) ; port GND
nRST: U1#6.24(~{RESET}) ; port nRST
PLLFILT: C15.1 R4#5.1 U1#6.16(PLLFILT)
VDRIVE: Q1.B R2#5.1 U1#6.3(VDRIVE)
NetC14_2: C14.2 R1#5.2
NetC16_1: C16.1 R4#5.2
NetD1#2_1: D1#2.1 R5#4.2
NetR3#5_1: R3#5.1 U1#6.34(SELFBOOT)
NetR5#4_1: R5#4.1 U1#6.45(MP6)
NetU1#6_4: U1#6.4(SPDIFIN) ; port SPDIF/RX
NetU1#6_21: U1#6.21(XTALIN/MCLK) ; port SCKI
NetU1#6_30: U1#6.30(MISO/SDA) ; port I2C_BUS.SDA
NetU1#6_31: U1#6.31(SCLK/SCL) ; port I2C_BUS.SCL
NetU1#6_39: U1#6.39(LRCLK_OUT0/MP4) ; port DCK_OUT.LRCK
NetU1#6_40: U1#6.40(BCLK_OUT0) ; port DCK_OUT.BCK
NetU1#6_41: U1#6.41(SDATA_OUT0) ; port DOUT0
NetU1#6_57: U1#6.57(BCLK_IN0) ; port DCK_IN.BCK
NetU1#6_58: U1#6.58(LRCLK_IN0/MP10) ; port DCK_IN.LRCK
NetU1#6_59: U1#6.59(SDATA_IN0) ; port DIN0

Not connected (* = marked no-connect by the designer): U1#6 5(SPDIFOUT)* 8(AUXADC0)* 9(AUXADC1)* 10(AUXADC2)* 11(AUXADC3)* 12(AUXADC4)* 13(AUXADC5)* 22(XTALOUT)* 23(CLKOUT)* 26(SS_M/MP0)* 27(MOSI_M/MP1)* 28(SCL_M/SCLK_M/MP2)* 29(SDA_M/MISO_M/MP3)* 42(LRCLK_OUT1/MP5)* 43(BCLK_OUT1)* 44(SDATA_OUT1)* 46(MP7)* 47(LRCLK_OUT2/MP8)* 48(BCLK_OUT2)* 49(SDATA_OUT2)* 50(LRCLK_OUT3/MP9)* 51(BCLK_OUT3)* 52(SDATA_OUT3)* 60(BCLK_IN1)* 61(LRCLK_IN1/MP11)* 62(SDATA_IN1)* 63(THD_M)* 64(THD_P)* 65(BCLK_IN2)* 66(LRCLK_IN2/MP12)* 67(SDATA_IN2)* 68(BCLK_IN3)* 69(LRCLK_IN3/MP13)* 70(SDATA_IN3)*

### Notes on the sheet
- POW + UP
- OUTPUT

### Library data of the parts
C1#8 C2#7 C3#6 C4#7 C5#6 C6#6 C7#4 C8#4 C9#4 C10#2 C11#2 C12-C16 = CAP-SMD
  C1#8 C6#6 C8#4 C14: JLCPart: C96446
  C2#7 C3#6 C4#7 C5#6 C7#4 C9#4 C10#2 C11#2 C12 C13: JLCPart: C307331
  C15: JLCPart: C363511
  C16: JLCPart: C527017
D1#2 = LED-SMD
F1 = YI201209U301-2R0T: 100mΩ ±25% 300Ω@100MHz 0805; JLCPart: C2858467
R1#5 R2#5 R3#5 R4#5 R5#4 = RES-SMD
  R1#5: JLCPart: C308364
  R2#5 R3#5: JLCPart: C11702
  R4#5: JLCPart: C517692
U1#6 = ADAU1452WBCPZ-RL: SigmaDSP 294.912 MHz, 32-bit Audio Processor; JLCPart: C462188
Q1 = FZT953: JLCPart: C499616

## Assembly variants
For Assembly: not fitted J1 J1_CTRL J2 J2_CTRL J3 J3_CTRL J4 J4_CTRL J5 J5_CTRL J6 J6_CTRL J7 J7_CTRL J8 J8_CTRL J9_CTRL J10_CTRL J11_CTRL J12_CTRL J12A_CTRL J12B_CTRL U1_POW U2_POW